# Altium schematic sheet power.SchDoc: Power
size A4; Address4: Niklas Fauth; Revision: V1.0; SheetNumber: 1; SheetTotal: 5
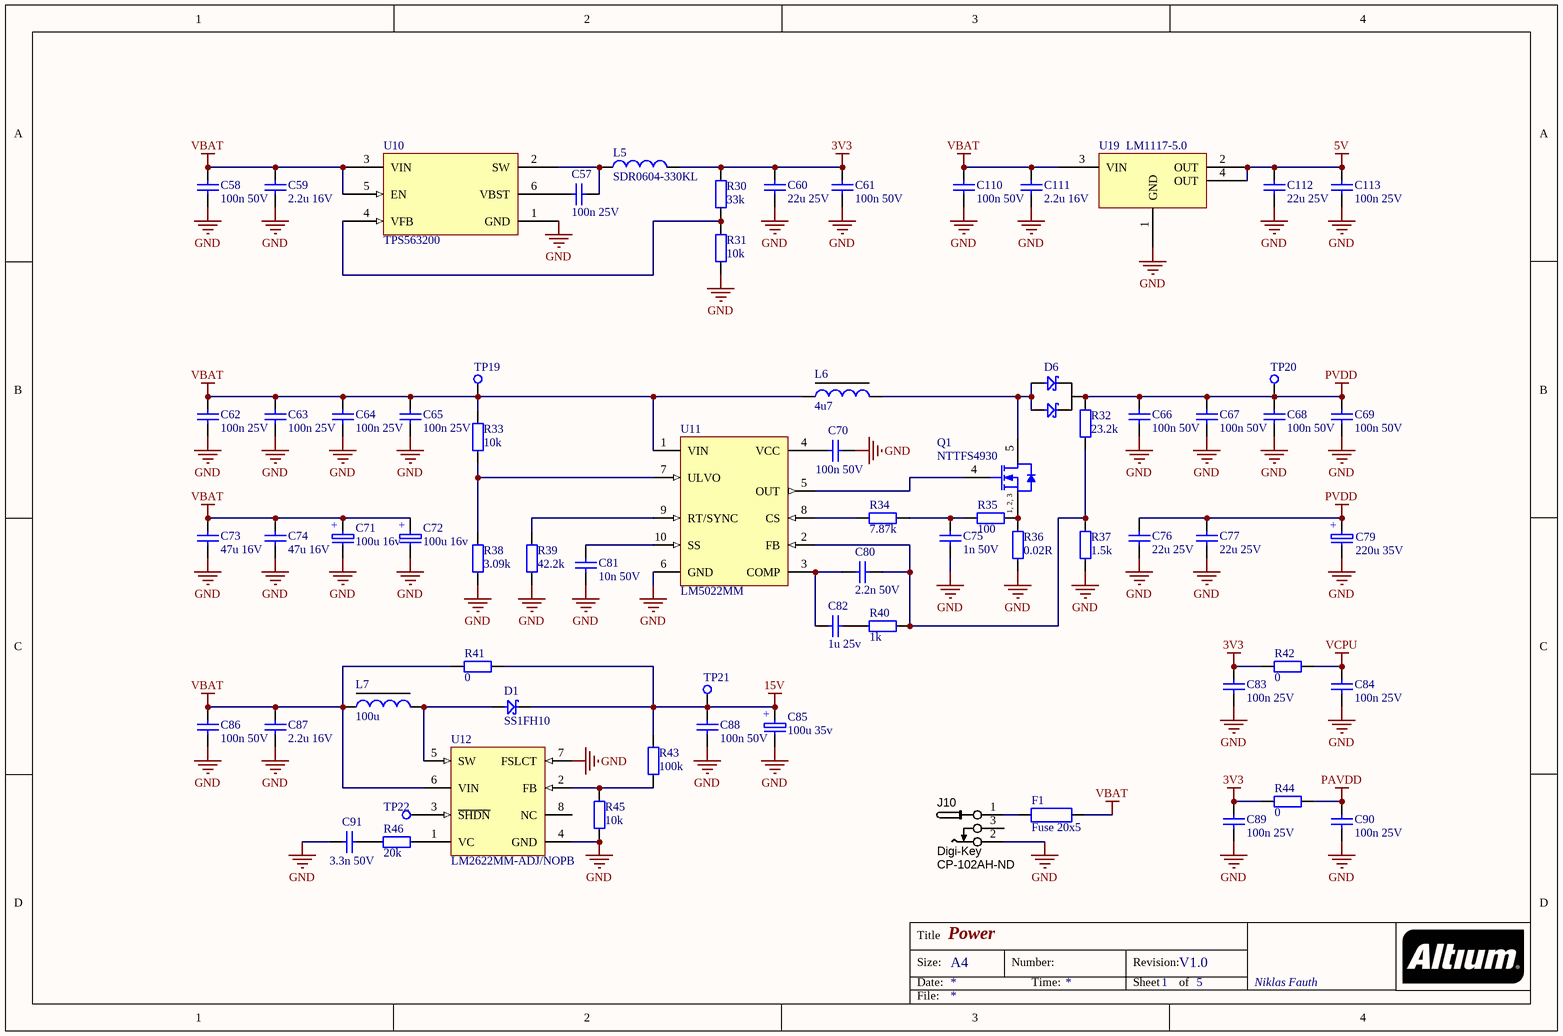
[diagram p0: power.SchDoc]

## Parts
C57  100n 25V  [C-0603-H]
C58  100n 50V  [C-0603-H]
C59  2.2u 16V  [C-0603-H]
C60  22u 25V  [C-1210-M]
C61  100n 50V  [C-0603-H]
C62  100n 25V  [C-0603-H]
C63  100n 25V  [C-0603-H]
C64  100n 25V  [C-0603-H]
C65  100n 25V  [C-0603-H]
C66  100n 50V  [C-0603-H]
C67  100n 50V  [C-0603-H]
C68  100n 50V  [C-0603-H]
C69  100n 50V  [C-0603-H]
C70  100n 50V  [C-0603-H]
C71  100u 16v  [SMD-6.3-5.4]
C72  100u 16v  [SMD-6.3-5.4]
C73  47u 16V  [C-1210-M]
C74  47u 16V  [C-1210-M]
C75  1n 50V  [C-0603-H]
C76  22u 25V  [C-1210-M]
C77  22u 25V  [C-1210-M]
C79  220u 35V  [SMD-10x10]
C80  2.2n 50V  [C-0603-H]
C81  10n 50V  [C-0603-H]
C82  1u 25v  [C-0603-H]
C83  100n 25V  [C-0603-H]
C84  100n 25V  [C-0603-H]
C85  100u 35v  [SMD-6.3-7.7]
C86  100n 50V  [C-0603-H]
C87  2.2u 16V  [C-0603-H]
C88  100n 50V  [C-0603-H]
C89  100n 25V  [C-0603-H]
C90  100n 25V  [C-0603-H]
C91  3.3n 50V  [C-0603-H]
C110  100n 50V  [C-0603-H]
C111  2.2u 16V  [C-0603-H]
C112  22u 25V  [C-1210-M]
C113  100n 25V  [C-0603-H]
D1  SS1FH10  [DO-219AB (SMF)]
D6  6CWQ06FN  [TO-277A]  (value not drawn)
F1  Fuse 20x5  [FUSE-22.5]
J10  Supplier 1: Digi-Key  Supplier Part Number 1: CP-102AH-ND  [CONN_PWR_JACK_2.1x5.5mm]  (hidden comment: CONN_PWR_JACK_2.1x5.5mm)
L5  SDR0604-330KL  [SDR0604]
L6  4u7  [SRP1250]
L7  100u  [SRN6028]
Q1  NTTFS4930  [ONSC-WDFN-8-511AB_V]
R30  33k  [R-0603-H]
R31  10k  [R-0603-H]
R32  23.2k  [R-0603-M]
R33  10k  [R-0603-H]
R34  7.87k  [R-0603-M]
R35  100  [R-0603-M]
R36  0.02R  [R-1206-M]
R37  1.5k  [R-0603-M]
R38  3.09k  [R-0603-M]
R39  42.2k  [R-0603-M]
R40  1k  [R-0603-M]
R41  0  [R-0603-M]
R42  0  [R-0603-M]
R43  100k  [R-0603-M]
R44  0  [R-0603-M]
R45  10k  [R-0603-H]
R46  20k  [R-0603-M]
TP19  TP-SMD  [TP]  (value not drawn)
TP20  TP-SMD  [TP]  (value not drawn)
TP21  TP-SMD  [TP]  (value not drawn)
TP22  TP-SMD  [TP]  (value not drawn)
U10  TPS563200  [SOT23-6]
U11  LM5022MM  [DGS0010A_M]
U12  LM2622MM-ADJ/NOPB  [DGK0008A_L]
U19  LM1117-5.0  [SOT-223]

## Nets
3V3: C60.2 C61.2 C83.2 C89.2 L5.2 R30.2 R42.1 R44.1
5V: C112.2 C113.2 U19.2(OUT) U19.4(OUT)
15V: C85.2 C88.1 D1.2(kt) R41.2 R43.2 TP21.1
GND: C58.1 C59.1 C60.1 C61.1 C62.1 C63.1 C64.1 C65.1 C66.1 C67.1 C68.1 C69.1 C70.2 C71.1 C72.1 C73.1 C74.1 C75.1 C76.1 C77.1 C79.1 C81.1 C83.1 C84.1 C85.1 C86.1 C87.1 C88.2 C89.1 C90.1 C91.1 C110.1 C111.1 C112.1 C113.1 J10.2 R31.1 R36.1 R37.1 R38.1 R39.1 R45.2 U10.1(GND) U11.6(GND) U12.4(GND) U12.7(FSLCT) U19.1(GND)
PAVDD: C90.2 R44.2
PVDD: C66.2 C67.2 C68.2 C69.2 C76.2 C77.2 C79.2 D6.2(Ka) R32.2 TP20.1
VBAT: C58.2 C59.2 C62.2 C63.2 C64.2 C65.2 C71.2 C72.2 C73.2 C74.2 C86.2 C87.2 C110.2 C111.2 F1.2(V+) L6.1 L7.1 R33.2 R41.1 TP19.1 U10.3(VIN) U10.5(EN) U11.1(VIN) U12.6(VIN) U19.3(VIN)
VCPU: C84.2 R42.2
NetC57_1: C57.1 L5.1 U10.2(SW)
NetC57_2: C57.2 U10.6(VBST)
NetC70_1: C70.1 U11.4(VCC)
NetC75_2: C75.2 R34.2 R35.1
NetC80_1: C80.1 R32.1 R37.2 R40.1 U11.2(FB)
NetC80_2: C80.2 C82.2 U11.3(COMP)
NetC81_2: C81.2 U11.10(SS)
NetC82_1: C82.1 R40.2
NetC91_2: C91.2 R46.1
NetD1_1: D1.1(an) L7.2 U12.5(SW)
NetD6_1: D6.1(an1) D6.3(an2) L6.2 Q1.5(D)
NetF1_1: F1.1(V+) J10.1
NetQ1_1: Q1.1(S) Q1.2(S) Q1.3(S) R35.2 R36.2
NetQ1_4: Q1.4(G) U11.5(OUT)
NetR30_1: R30.1 R31.2 U10.4(VFB)
NetR33_1: R33.1 R38.2 U11.7(ULVO)
NetR34_1: R34.1 U11.8(CS)
NetR39_2: R39.2 U11.9(RT/SYNC)
NetR43_1: R43.1 R45.1 U12.2(FB)
NetR46_2: R46.2 U12.1(VC)
NetTP22_1: TP22.1 U12.3(~{SHDN})

Not connected (* = marked no-connect by the designer): J10 3; U12 8(NC)

## Notes on the sheet
- Title
- Size:
- Date:
- A4
- Number:
- Time:
- Revision:
- Sheet
- of
- File:
- (in symbol CE-SMD-100u-16V) +
- (in symbol CE-SMD-100u-35V) +
- (in symbol CE-SMD-220u-35V) +
- (in symbol CMP-1058-01046-1) 1, 2, 3

## Library data of the parts
C57 C62-C65 C83 C84 C89 C90 C113 = C-0603-100n-25V: Capacitor 100n 25V; Supplier 1: Mouser; Supplier Part Number 1: 80-C0603C104K3R
C58 C61 C66-C70 C86 C88 C110 = C-0603-100n-50V: Capacitor 100n 50V; Supplier 1: Mouser; Supplier Part Number 1: 80-C0603C104K5RAUTO
C59 C87 C111 = C-0603-2u2-16V: Capacitor 2.2uF 16V; Supplier 1: Mouser; Supplier Part Number 1: 80-C0603C225K4P
C60 C76 C77 C112 = C-1210-22u-25V: Capacitor 22uF 25V; Supplier 1: Mouser; Supplier Part Number 1: 80-C1210C226M3R
C71 C72 = CE-SMD-100u-16V: electrolytic capacitor 100uF 16V; Supplier 1: Mouser; Supplier Part Number 1: 647-UWX1C101MCL1
C73 C74 = C-1210-47u-16V: Capacitor 47uF 16V; Supplier 1: Mouser; Supplier Part Number 1: 80-C1210C476M4P
C75 = C-0603-1n-50V: Capacitor 1nF 50V; Supplier 1: Mouser; Supplier Part Number 1: 80-C0603C102J5G
C79 = CE-SMD-220u-35V: electrolytic capacitor 220u 35V; Supplier 1: Mouser; Supplier Part Number 1: 661-EMZF350A221MJA0G
C80 = C-0603-2n2-50V: Capacitor 2.2n 50V; Supplier 1: Mouser; Supplier Part Number 1: 80-C0603C222F5G
C81 = C-0603-10n-50V: Capacitor 10nF 50V; Supplier 1: Mouser; Supplier Part Number 1: 80-C0603C103K5RAC
C82 = C-0603-1u-25V: Capacitor 1uF 25V; Supplier 1: Mouser; Supplier Part Number 1: 80-C0603C105K3R
C85 = CE-SMD-100u-35V: electrolytic capacitor 100uF 35V; Supplier 1: Mouser; Supplier Part Number 1: 647-UWT1V101MCL1S
C91 = C-0603-3n3-50V: Capacitor 3.3n 50V; Supplier 1: Mouser; Supplier Part Number 1: 80-C0603C332F5G
D1 = D-SS1FH10: Supplier 1: Mouser; Supplier Part Number 1: 78-SS1FH10HM3/H
D6 = D-SS10PH10: SS10PH10; Supplier 1: Mouser; Supplier Part Number 1: 625-SS10PH10-M3
F1 = FUSE-20x5: Supplier 1: Mouser; Supplier Part Number 1: 693-0031.8201
J10 = CONN_PWR_JACK_2.1x5.5mm: Power Connector, THT, 2.1mm ID, 5.5mm OD; Manufacturer 1: CUI Inc; Manufacturer Part Number 1: PJ-102AH; SCDType: undef; Category: Connectors; Mounting Type: Through Hole; Package / Case: PCB mount; Value: 2.1mm ID, 5.5mm OD
L5 = L-SDR0604-330KL: Supplier 1: Mouser; Supplier Part Number 1: 652-SDR0604-330KL
L6 = L-4u7-SRP1250: SRP1250-472; Supplier 1: Mouser; Supplier Part Number 1: 652-SRP1250-4R7M
L7 = L-100u-SRN6028: SRN6028-101M; Supplier 1: Mouser; Supplier Part Number 1: 652-SRN6028-101M
Q1 = CMP-1058-01046-1: Power MOSFET, 30 V, 23 A, Single N-Channel, 8-Pin WDFN, Pb-Free, Tape and Reel; PartNumber: NTTFS4930NTAG; Manufacturer: On Semiconductor; ID Max (A): 23; Crss Typ (pF): 101; Channel Polarity: N Channel; V(BR)DSS Min (V): 30; VGS(th) Max (V): 2.2; Qrr Typ (nC): 4.6; Ciss Typ (pF): 476; Coss Typ (pF): 197; VGS Max (V): 20; RoHS: Pb-Free; Mounting Technology: Surface Mount; ComponentLink1URL: http://www.onsemi.com/; ComponentLink3URL: http://www.onsemi.com/pub_link/Collateral/511AB.PDF; ComponentLink3Description: Package Specification; ComponentLink2URL: http://www.onsemi.cn/pub_link/Collateral/NTTFS4930N-D.PDF; Packing: Tape and Reel; ComponentLink1Description: Manufacturer URL; PackageVersion: Rev. D, 04/2012; DatasheetVersion: Rev. 2; Configuration: Single; Package Type: u8FL / WDFN-8; PackageDescription: 8-Pin Small Outline No-Lead, Body 3.05 x 3.05 mm, Pitch 0.65 mm; PackageReference: WDFN-8-511AB; ComponentLink2Description: Datasheet
R30 = R-0603-33k: Resistor 33k; Supplier 1: Mouser; Supplier Part Number 1: 71-CRCW060333K0FKEB
R31 R33 R45 = R-0603-10k: Resistor 10k; Supplier 1: Mouser; Supplier Part Number 1: 71-CRCW0603-10K-E3
R32 = R-0603-23k3: Resistor 23k3; Supplier 1: Mouser; Supplier Part Number 1: 71-CRCW0603-23.3K-E3
R34 = R-0603-7k87: Resistor 7.87k; Supplier 1: Mouser; Supplier Part Number 1: 71-CRCW0603-7.87K-E3
R35 = R-0603-100: Resistor 100; Supplier 1: Mouser; Supplier Part Number 1: 71-CRCW0603-100-E3
R36 = R-1206-0R02: Resistor 0.02; Supplier 1: Mouser; Supplier Part Number 1: 756-LRMAM1206R02FT5
R37 = R-0603-1k5: Resistor 1.5k; Supplier 1: Mouser; Supplier Part Number 1: 71-CRCW0603-1.5K-E3
R38 = R-0603-3k09: Resistor 3.09k; Supplier 1: Mouser; Supplier Part Number 1: 71-CRCW0603-3.09K-E3
R39 = R-0603-42k2: Resistor 42.2k; Supplier 1: Mouser; Supplier Part Number 1: 71-CRCW0603-42.2K-E3
R40 = R-0603-1k: Resistor 1k; Supplier 1: Mouser; Supplier Part Number 1: 71-CRCW0603-1.0K-E3
R41 R42 R44 = R-0603-0: Resistor 0; Supplier 1: Mouser; Supplier Part Number 1: 71-CRCW0603-0-E3; Resistance: 0
R43 = R-0603-100k: Resistor 100k; Supplier 1: Mouser; Supplier Part Number 1: 71-CRCW0603-100K-E3
R46 = R-0603-20k: Resistor 20k; Resistance: 20k; Supplier 1: Mouser; Supplier Part Number 1: 71-CRCW0603-20K-E3
U10 = TPS563200: 4.5-V To 17-V Input, 3-A Synchronous Step-Down Voltage Regulator; Supplier 1: Mouser; Supplier Part Number 1: 595-TPS563200DDCR
U11 = CMP-0069-01840-3: 60V Low Side Controller for Boost and SEPIC, 10-pin MSOP; Manufacturer: Texas Instruments; CompType: Switcher; PackageTopMarking: ZXTT*5022; PowerWise: Y; PinCount: 10; ComponentLink1URL: http://www.ti.com/general/docs/lit/getliterature.tsp?genericPartNumber=LM5022&fileType=pdf; RoHS: N; PackageReference: DGS0010A; Code_JEDEC: MO-187-BA; ComponentLink1Description: Datasheet URL; PackageDescription: Mini-SO, Molded, .118 x .118 x .034in Body, 10 Lead, .0197in Pitch
U12 = CMP-0069-01735-3: 600kHz/1.3MHz Step-up PWM DC/DC Converter, 8-pin MSOP, Pb-Free; Manufacturer: Texas Instruments; CompType: Switcher; PowerWise: N; PackageTopMarking: ZXTT*S18B; RoHS: Y; PackageDescription: MINI SOIC, .118 x .118 x .034in, 8 Lead, .0256in Pitch; ComponentLink1Description: Datasheet URL; Code_JEDEC: MO-187-AA; PackageReference: DGK0008A; PinCount: 8; ComponentLink1URL: http://www.ti.com/general/docs/lit/getliterature.tsp?genericPartNumber=LM2622&fileType=pdf
U19 = LM1117-5.0: 5V voltage regulator; Supplier 1: Mouser; Supplier Part Number 1: 926-LM1117MPX5.0NOPB